# Altium schematic sheet Sheet1.SchDoc
size A3
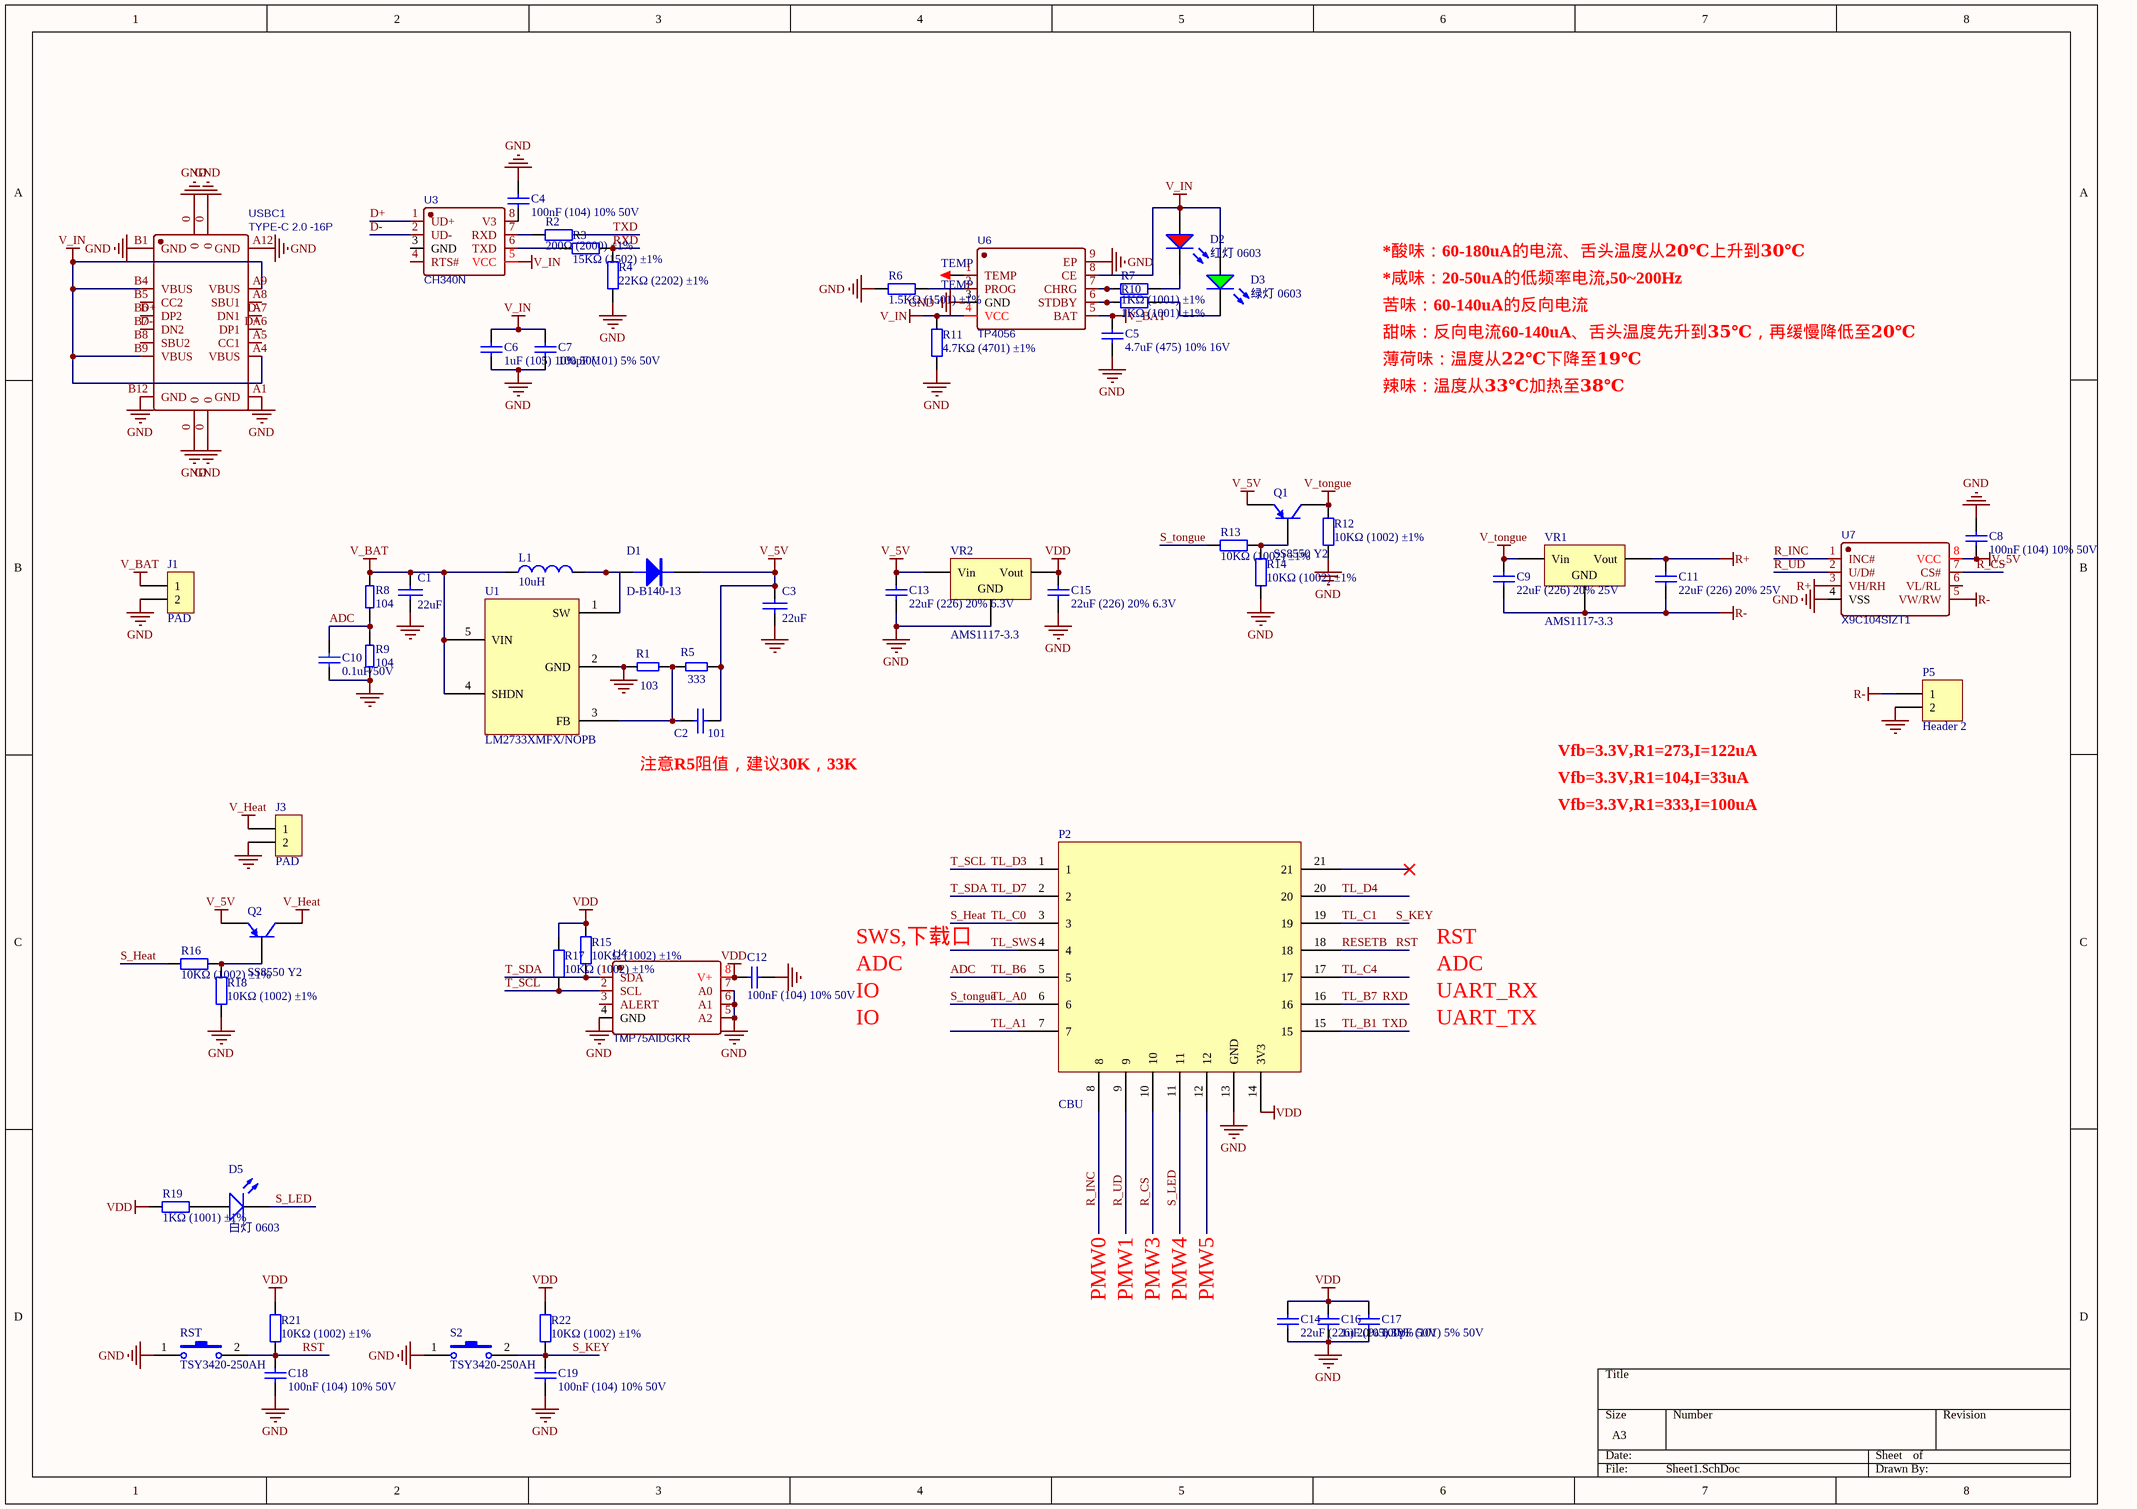
[diagram p0: Sheet1.SchDoc]

## Parts
C1  22uF  [C1206]
C2  101  [C0603]
C3  22uF  [C1206]
C4  100nF (104) 10% 50V  [0603_C]
C5  4.7uF (475) 10% 16V  [0603_C]
C6  1uF (105) 10% 50V  [0603_C]
C7  100pF (101) 5% 50V  [0603_C]
C8  100nF (104) 10% 50V  [0603_C]
C9  22uF (226) 20% 25V  [0805_C]
C10  0.1uF/50V  [C0603_GRM18]
C11  22uF (226) 20% 25V  [0805_C]
C12  100nF (104) 10% 50V  [0603_C]
C13  22uF (226) 20% 6.3V  [0603_C]
C14  22uF (226) 20% 6.3V  [0603_C]
C15  22uF (226) 20% 6.3V  [0603_C]
C16  1uF (105) 10% 50V  [0603_C]
C17  100pF (101) 5% 50V  [0603_C]
C18  100nF (104) 10% 50V  [0603_C]
C19  100nF (104) 10% 50V  [0603_C]
D1  D-B140-13  [XF-SS12C]
D2  红灯 0603  [0603_LED_S1]
D3  绿灯 0603  [0603_LED_S1]
D5  白灯 0603  [0603_LED_S1]
J1  PAD  [POW_5#]
J3  PAD  [HDR1X2]
L1  value 10uH  [CD73]  (hidden comment: 4.7uH)
P2  CBU  [CBU-PCBA]
P5  Header 2  [HDR1X2]
Q1  SS8550 Y2  [SOT-23(SOT-23-3)]
Q2  SS8550 Y2  [SOT-23(SOT-23-3)]
R1  103  [R0603]
R2  200Ω (2000) ±1%  [0603_R]
R3  15KΩ (1502) ±1%  [0603_R]
R4  22KΩ (2202) ±1%  [0603_R]
R5  333  [R0603]
R6  1.5KΩ (1501) ±1%  [0603_R]
R7  1KΩ (1001) ±1%  [0603_R]
R8  104  [R0603]
R9  104  [R0603]
R10  1KΩ (1001) ±1%  [0603_R]
R11  4.7KΩ (4701) ±1%  [0603_R]
R12  10KΩ (1002) ±1%  [0603_R]
R13  10KΩ (1002) ±1%  [0603_R]
R14  10KΩ (1002) ±1%  [0603_R]
R15  10KΩ (1002) ±1%  [0603_R]
R16  10KΩ (1002) ±1%  [0603_R]
R17  10KΩ (1002) ±1%  [0603_R]
R18  10KΩ (1002) ±1%  [0603_R]
R19  1KΩ (1001) ±1%  [0603_R]
R21  10KΩ (1002) ±1%  [0603_R]
R22  10KΩ (1002) ±1%  [0603_R]
RST  TSY3420-250AH  [TSW SMD-3*6*4.3]
S2  TSY3420-250AH  [TSW SMD-3*6*4.3]
TEMP  TEMP  [TEST 1]
U1  LM2733XMFX/NOPB  [SOT23-5]
U3  CH340N  [SOP-8]
U4  TMP75AIDGKR  [VSSOP-8_L3.0-W3.0-P0.65-LS5.0-BL]
U6  TP4056  [ESOP8_N]
U7  X9C104SIZT1  [SOIC-8]
USBC1  TYPE-C 2.0 -16P  [USB-C-SMD_TYPE-C-USB-5]
VR1  AMS1117-3.3  [SOT-223]
VR2  AMS1117-3.3  [SOT-223]

## Nets
GND: C1.2 C3.2 C4.2 C5.1 C6.1 C7.1 C8.2 C10.1 C12.2 C13.1 C14.1 C15.1 C16.1 C17.1 C18.1 C19.1 J1.2 J3.2 P2.13(GND) P5.2 R1.1 R4.1 R6.1 R9.1 R11.1 R12.1 R14.2 R18.1 RST.1 S2.1 U1.2(GND) U4.4(GND) U4.5(A2) U4.6(A1) U4.7(A0) U6.3(GND) U6.9(EP) U7.4(VSS) USBC1.0 USBC1.A1(GND) USBC1.A12(GND) USBC1.B1(GND) USBC1.B12(GND) VR2.1(GND)
R+: C11.2 U7.3(VH/RH) VR1.2(Vout)
R-: C9.1 C11.1 P5.1 U7.5(VW/RW) VR1.1(GND)
V_5V: C2.1 C3.1 C8.1 C13.2 D1.K Q1.2(E) Q2.2(E) R5.1 U7.8(VCC) VR2.3(Vin)
V_BAT: C1.1 C5.2 J1.1 L1.1 R8.2 U1.4(SHDN) U1.5(VIN) U6.5(BAT)
V_Heat: J3.1 Q2.3(C)
V_IN: C6.2 C7.2 D2.A D3.A R11.2 U3.5(VCC) U6.4(VCC) U6.8(CE) USBC1.A4(VBUS) USBC1.A9(VBUS) USBC1.B4(VBUS) USBC1.B9(VBUS)
V_tongue: C9.2 Q1.3(C) R12.2 VR1.3(Vin)
VDD: C12.1 C14.2 C15.2 C16.2 C17.2 P2.14(3V3) R15.2 R17.2 R19.1 R21.2 R22.2 U4.8(V+) VR2.2(Vout)
ADC: C10.2 P2.5 R8.1 R9.2  [also labelled TL_B6]
D+: U3.1(UD+) USBC1.A6(DP1) USBC1.B6(DP2)
D-: U3.2(UD-) USBC1.A7(DN1) USBC1.B7(DN2)
R_CS: P2.10 U7.7(CS#)
R_INC: P2.8 U7.1(INC#)
R_UD: P2.9 U7.2(U/D#)
RESETB: C18.2 P2.18 R21.1 RST.2  [also labelled RST]
RXD: P2.16 R3.2 R4.2  [also labelled TL_B7]
S_Heat: P2.3 R16.1  [also labelled TL_C0]
S_KEY: C19.2 P2.19 R22.1 S2.2  [also labelled TL_C1]
S_LED: D5.K P2.11
S_tongue: P2.6 R13.2  [also labelled TL_A0]
T_SCL: P2.1 R17.1 U4.2(SCL)  [also labelled TL_D3]
T_SDA: P2.2 R15.1 U4.1(SDA)  [also labelled TL_D7]
TL_A1: P2.7
TL_B1: P2.15 R2.2  [also labelled TXD]
TL_C4: P2.17
TL_D4: P2.20
TL_SWS: P2.4
NetC2_2: C2.2 R1.2 R5.2 U1.3(FB)
NetC4_1: C4.1 U3.8(V3)
NetD1_A: D1.A L1.2 U1.1(SW)
NetD2_K: D2.K R7.2
NetD3_K: D3.K R10.2
NetD5_A: D5.A R19.2
NetQ1_1: Q1.1(B) R13.1 R14.1
NetQ2_1: Q2.1(B) R16.2 R18.2
NetR2_1: R2.1 U3.7(RXD)
NetR3_1: R3.1 U3.6(TXD)
NetR6_2: R6.2 U6.2(PROG)
NetR7_1: R7.1 U6.7(CHRG)
NetR10_1: R10.1 U6.6(STDBY)
NetTEMP_1: TEMP.1 U6.1(TEMP)

Not connected (* = marked no-connect by the designer): P2 12 21*; U3 3(GND) 4(RTS#); U4 3(ALERT); U7 6(VL/RL); USBC1 A5(CC1) A8(SBU1) B5(CC2) B8(SBU2)

## Notes on the sheet
- *酸味：60-180uA的电流、舌头温度从20℃上升到30℃
- *咸味：20-50uA的低频率电流,50~200Hz
- 苦味：60-140uA的反向电流
- 甜味：反向电流60-140uA、舌头温度先升到35℃，再缓慢降低至20℃
- 薄荷味：温度从22℃下降至19℃
- 辣味：温度从33℃加热至38℃
- (near C2) 注意R5阻值，建议30K，33K
- Vfb=3.3V,R1=104,I=33uA
- Vfb=3.3V,R1=273,I=122uA
- Vfb=3.3V,R1=333,I=100uA
- SWS,下载口
- ADC
- RST
- IO
- UART_TX
- UART_RX
- PMW0
- PMW1
- PMW3
- PMW4
- PMW5

## Library data of the parts
C1 C3 = C1
C2 = CAP: Capacitor
C4 C8 C12 C18 C19 = 0603 100nF (104) 10% 50V: 贴片电容; ComponentLink1Description: 供应商链接; ComponentLink1URL: http://www.szlcsc.com/product/details_15331.html; Package: 0603; Supplier: LC; SuppliersPartNumber: C14663
C5 = 0603 4.7uF (475) 10% 16V: 贴片电容; ComponentLink1Description: 供应商链接; ComponentLink1URL: http://www.szlcsc.com/product/details_20375.html; Package: 0603; Supplier: LC; SuppliersPartNumber: C19666
C6 C16 = 0603 1uF (105) 10% 50V: 贴片电容; ComponentLink1Description: 供应商链接; ComponentLink1URL: http://www.szlcsc.com/product/details_16531.html; Package: 0603; Supplier: LC; SuppliersPartNumber: C15849
C7 C17 = 0603 100pF (101) 5% 50V: 贴片电容; ComponentLink1Description: 供应商链接; ComponentLink1URL: http://www.szlcsc.com/product/details_15530.html; Package: 0603; Supplier: LC; SuppliersPartNumber: C14858
C9 C11 = 0805 22uF (226) 20% 25V: 贴片电容; ComponentLink1Description: 供应商链接; ComponentLink1URL: http://www.szlcsc.com/product/details_46786.html; Package: 0805; Supplier: LC; SuppliersPartNumber: C45783
C10 = 1.02.05.00150: 无极性电容; 物料通用性等级: 高; 工作温度: null; 物料描述: 瓷介电容;贴片;X7R;0.1UF;±10%;50V;0603; 制造商: 三星(SAMSUNG); 制造商型号: CL10B104KB8NNNC; Orcad Library: C; Orcad Library Path: Z:\tuya_lib\sch-lib\DISCRETE.OLB; Orcad Footprint: c0603,c0603a; Orcad Footprint Path: Z:\tuya_lib\footprint; 管脚数量: 2; 安装方式: 贴片; 物料类目: 瓷介电容; 物料状态: 已发布; 修改人: system; 物料生产状态: 量产; Part Number: 1.02.05.00150; Value: 0.1uF/50V; ComponentLink2Description: null; ComponentLink2URL: null; 器件高度: null; 更新时间: 2021-03-25 10:51:02; ALT_SYMBOLS: c0603,c0603a
C13-C15 = 0603 22uF (226) 20% 6.3V: 贴片电容; ComponentLink1Description: 供应商链接; ComponentLink1URL: http://www.szlcsc.com/product/details_60514.html; Package: 0603; Supplier: LC; SuppliersPartNumber: C59461
D1 = DIODE: $MaterialID: 40300.000001; $MaterialClass: Diode; Specification: D-B140-13
D2 = 0603 红灯: 发光二极管; ComponentLink1Description: 供应商链接; ComponentLink1URL: http://www.szlcsc.com/product/details_2659.html; Package: 0603; Supplier: LC; SuppliersPartNumber: C2286
D3 = 0603 绿灯: 发光二极管; ComponentLink1Description: 供应商链接; ComponentLink1URL: http://www.szlcsc.com/product/details_73152.html; Package: 0603; Supplier: LC; SuppliersPartNumber: C72043
D5 = 0603 白灯: 发光二极管; ComponentLink1Description: 供应商链接; ComponentLink1URL: http://www.szlcsc.com/product/details_2663.html; Package: 0603; Supplier: LC; SuppliersPartNumber: C2290
J1 J3 = CON2: Connector
L1 = Inductor: Code_IEC: 1005; Published: 8-Jun-2000; LatestRevisionDate: 29-May-2009; LatestRevisionNote: IPC-7351 Footprint Added.; PackageReference: CD73; Publisher: Altium Limited; PackageDescription: Chip Inductor; Code_JEITA: 0402
P2 = 0110: Part Number: 0110; 制造商: 涂鸦; Process: 贴片; Component Type: Standard; 描述: CBU; 制造商型号: CBU; Pin Count: 21; Value: CBU
P5 = Header 2: Header, 2-Pin; LatestRevisionDate: 17-Jul-2002; LatestRevisionNote: Re-released for DXP Platform.; Publisher: Altium Limited
Q1 Q2 = SOT-23 SS8550 Y2: 三极管; ComponentLink1Description: 供应商链接; ComponentLink1URL: http://www.szlcsc.com/product/details_9037.html; Package: SOT-23; Supplier: LC; SuppliersPartNumber: C8542
R1 R5 = RES-1: RES; Accuracy: ±1%
  R1: Value: 103
  R5: Value: 333
R2 = 0603 200Ω (2000) 1%: 贴片电阻; ComponentLink1Description: 供应商链接; ComponentLink1URL: http://www.szlcsc.com/product/details_8708.html; Package: 0603; Supplier: LC; SuppliersPartNumber: C8218
R3 = 0603 15KΩ (1502) 1%: 贴片电阻; ComponentLink1Description: 供应商链接; ComponentLink1URL: http://www.szlcsc.com/product/details_23536.html; Package: 0603; Supplier: LC; SuppliersPartNumber: C22809
R4 = 0603 22KΩ (2202) 1%: 贴片电阻; ComponentLink1Description: 供应商链接; ComponentLink1URL: http://www.szlcsc.com/product/details_32812.html; Package: 0603; Supplier: LC; SuppliersPartNumber: C31850
R6 = 0603 1.5KΩ (1501) 1%: 贴片电阻; ComponentLink1Description: 供应商链接; ComponentLink1URL: http://www.szlcsc.com/product/details_23570.html; Package: 0603; Supplier: LC; SuppliersPartNumber: C22843
R7 R10 R19 = 0603 1KΩ (1001) 1%: 贴片电阻; ComponentLink1Description: 供应商链接; ComponentLink1URL: http://www.szlcsc.com/product/details_21904.html; Package: 0603; Supplier: LC; SuppliersPartNumber: C21190
R8 R9 = RES-1: RES
R11 = 0603 4.7KΩ (4701) 1%: 贴片电阻; ComponentLink1Description: 供应商链接; ComponentLink1URL: http://www.szlcsc.com/product/details_23889.html; Package: 0603; Supplier: LC; SuppliersPartNumber: C23162
R12-R18 R21 R22 = 0603 10KΩ (1002) 1%: 贴片电阻; ComponentLink1Description: 供应商链接; ComponentLink1URL: http://www.szlcsc.com/product/details_26547.html; Package: 0603; Supplier: LC; SuppliersPartNumber: C25804
RST S2 = 1.13.04.00024: 2pin轻触开关（无固定脚）; 物料通用性等级: 中; 工作温度: null; 物料描述: 轻触开关;3*4*2MM;贴片;; 制造商: 欧麦特; Orcad Library: #N/A; 管脚数量: 2; 器件高度: 1.95mm; 安装方式: 贴片; 物料类目: 轻触开关; 物料状态: 已发布; 修改人: system; Part Number: 1.13.04.00024; Value: TSY3420-250AH; ComponentLink2Description: TSY3420-250AH规格书.pdf; ComponentLink2URL: file:///\\172.16.246.8\lib-ad\DBlib\Datasheet\开关资料\TSY3420-250AH规格书.pdf; 制造商型号: TSY3420-250AH; Orcad Library Path: #N/A; Orcad Footprint: #N/A; Orcad Footprint Path: #N/A; 更新时间: 2021-03-25 10:51:02; ALT_SYMBOLS: #N/A
TEMP = TEST: 测试点; 封装库: JiuGong Tech
U1 = LM2733: $MaterialClass: IC; $MaterialID: 40700.000017; Specification: LM2733XMFX/NOPB
U3 = CH340N: BOM_Manufacturer: WCH(Jiangsu Qin Heng); Contributor: LCSC; BOM_Paste Type: expand; BOM_Supplier: LCSC; BOM_Supplier Part: C506813; BOM_Manufacturer Part: CH340N; spicePre: U; spiceSymbolName: CH340N
U4 = TMP75AIDGKR: BOM_Manufacturer: TI; Contributor: LCSC; BOM_Paste Type: expand; BOM_Supplier: LCSC; BOM_Manufacturer Part: TMP75AIDGKR; BOM_Supplier Part: C105258; spicePre: U; spiceSymbolName: TMP75AIDGKR
U6 = TP4056_C725790: BOM_Manufacturer: UMW(Youtai Semiconductor Co., Ltd.); Contributor: LCSC; BOM_Paste Type: expand; BOM_Supplier: LCSC; BOM_Supplier Part: C725790; BOM_Manufacturer Part: TP4056; spicePre: U; spiceSymbolName: TP4056_C725790
U7 = X9C104SIZT1: BOM_Manufacturer: Intersil; BOM_Paste Type: expand; BOM_Supplier: LCSC; BOM_Manufacturer Part: X9C104SIZT1; image: //image.lceda.cn/szlcsc/C11979.jpg; BOM_Supplier Part: C11979; spicePre: U; spiceSymbolName: X9C104SIZT1
USBC1 = USB2.0 Type-C 16Pin母座: USB2.0 Type-C 母座 16Pin; 封装库: JiuGong Tech
VR1 VR2 = SOT-223 AMS1117-3.3: 低压差线性稳压(LDO); ComponentLink1Description: 供应商链接; ComponentLink1URL: http://www.szlcsc.com/product/details_6652.html; Package: SOT-223; Supplier: LC; SuppliersPartNumber: C6186